# EAGLE design satshakit-grbl (EAGLE 8.4.3)

## Sheet 1 of 2
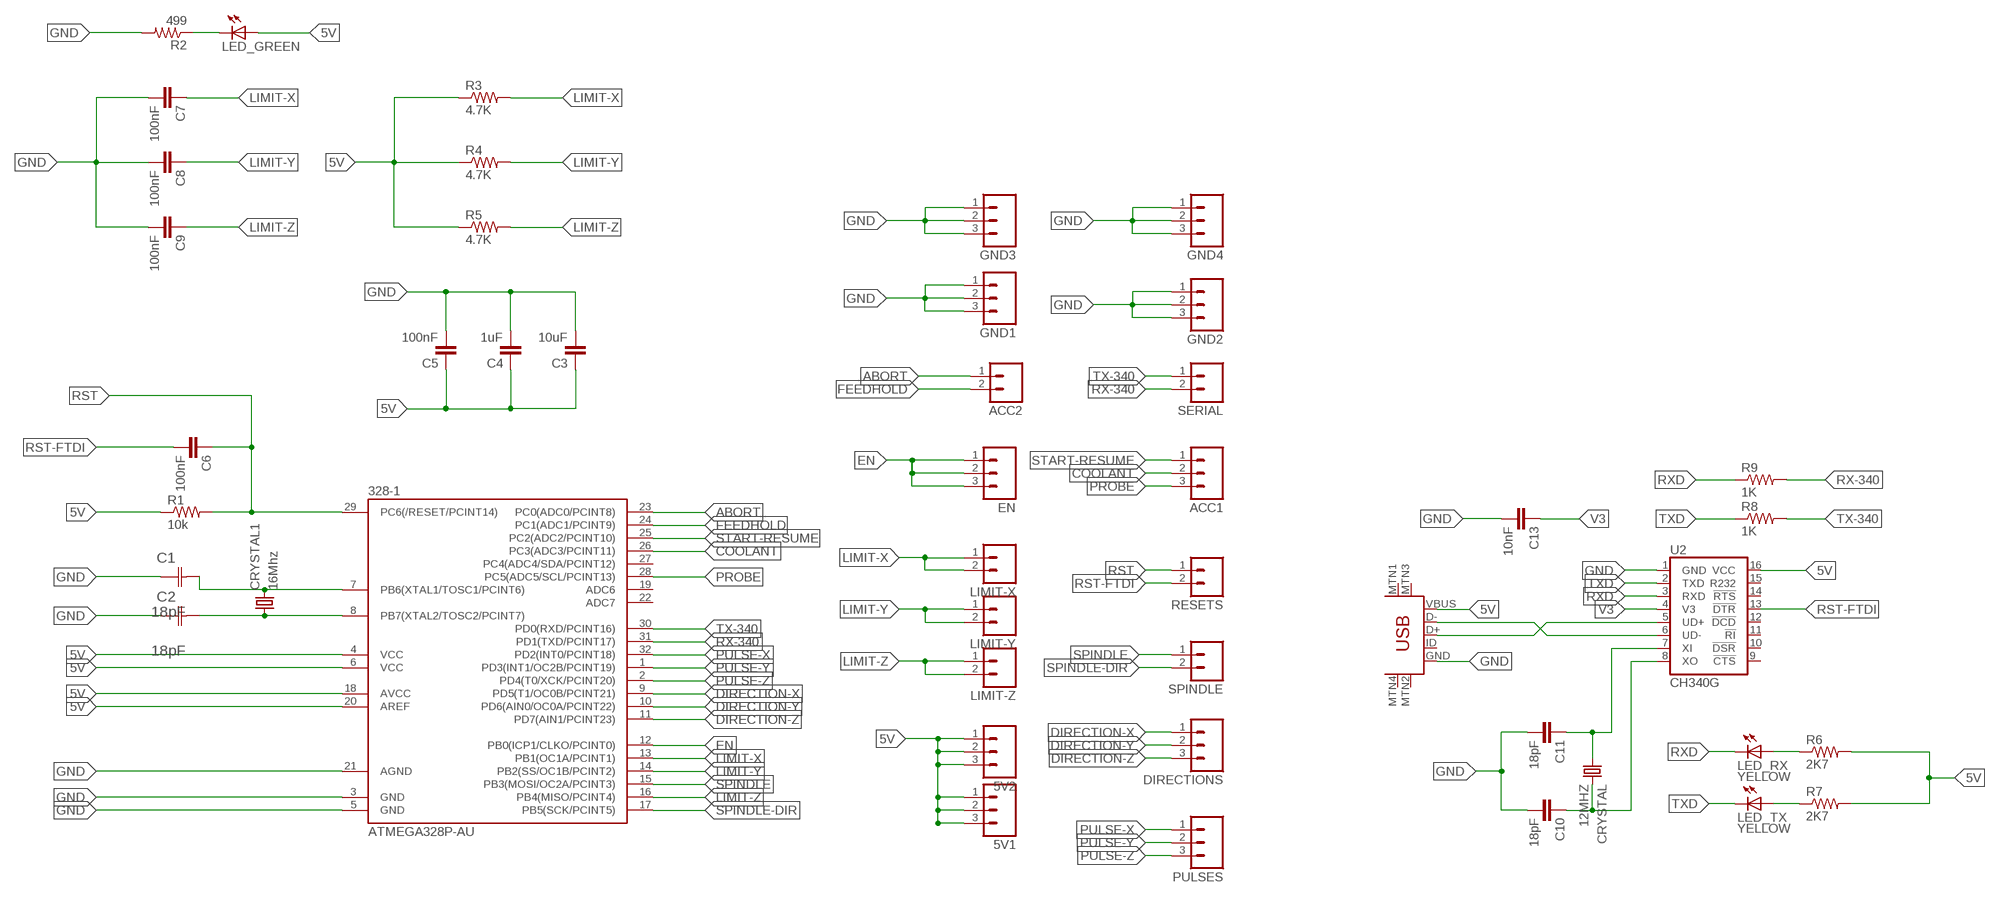
[diagram p0: schematic, sheet 1]

### Parts
5V1  M03  [03P]
5V2  M03  [03P]
328-1  ATMEGA328P-AU  ATMEGA48/88/168-AU  [TQFP32-08]
ACC1  M03  [03P]
ACC2  M02  [02P]
C1  18pF  0612ZC225MAT2A  [CAPC3216X178N]
C2  18pF  0612ZC225MAT2A  [CAPC3216X178N]
C3  10uF  CAP1206  [1206]
C4  1uF  CAP1206  [1206]
C5  100nF  CAP1206  [1206]
C6  100nF  CAP1206  [1206]
C7  100nF  CAP1206  [1206]
C8  100nF  CAP1206  [1206]
C9  100nF  CAP1206  [1206]
C10  18pF  CAP1206  [1206]
C11  18pF  CAP1206  [1206]
C13  10nF  CAP1206  [1206]
CRYSTAL  12MHZ  CSM-7X-DU  [CSM-7X-DU]
CRYSTAL1  16Mhz  CSM-7X-DU  [CSM-7X-DU]
DIRECTIONS  M03  [03P]
EN  M03  [03P]
GND1  M03  [03P]
GND2  M03  [03P]
GND3  M03  [03P]
GND4  M03  [03P]
LED_GREEN  LED1206  [1206]
LED_RX  YELLOW  LED  [LED1206]
LED_TX  YELLOW  LED  [LED1206]
LIMIT-X  M02  [02P]
LIMIT-Y  M02  [02P]
LIMIT-Z  M02  [02P]
PULSES  M03  [03P]
R1  10k  RESISTOR1206  [1206]
R2  499  RESISTOR1206  [1206]
R3  4.7K  RESISTOR1206  [1206]
R4  4.7K  RESISTOR1206  [1206]
R5  4.7K  RESISTOR1206  [1206]
R6  2K7  RES-US1206  [R1206]
R7  2K7  RES-US1206  [R1206]
R8  1K  RES-US1206  [R1206]
R9  1K  RES-US1206  [R1206]
RESETS  M02  [02P]
SERIAL  M02  [02P]
SPINDLE  M02  [02P]
U2  CH340G  CH340GSMD  [SO016]
U$7  USB-MINIB-5PIN  [USB-MINIB]

### Nets
5V: 5V1.1 5V1.2 5V1.3 5V2.1 5V2.2 5V2.3 328-1.4(VCC) 328-1.6(VCC) 328-1.18(AVCC) 328-1.20(AREF) C3.1 C4.1 C5.1 LED_GREEN.1(A) R1.1 R3.1 R4.1 R5.1 R6.2 R7.2 U2.16(VCC) U$7.VBUS
ABORT: 328-1.23(PC0(ADC0/PCINT8)) ACC2.1
COOLANT: 328-1.26(PC3(ADC3/PCINT11)) ACC1.2
DIRECTION-X: 328-1.9(PD5(T1/OC0B/PCINT21)) DIRECTIONS.1
DIRECTION-Y: 328-1.10(PD6(AIN0/OC0A/PCINT22)) DIRECTIONS.2
DIRECTION-Z: 328-1.11(PD7(AIN1/PCINT23)) DIRECTIONS.3
EN: 328-1.12(PB0(ICP1/CLKO/PCINT0)) EN.1 EN.2 EN.3
FEEDHOLD: 328-1.24(PC1(ADC1/PCINT9)) ACC2.2
GND: 328-1.3(GND) 328-1.5(GND) 328-1.21(AGND) C1.1(C1) C2.1(C1) C3.2 C4.2 C5.2 C7.2 C8.2 C9.2 C10.2 C11.2 C13.2 GND1.1 GND1.2 GND1.3 GND2.1 GND2.2 GND2.3 GND3.1 GND3.2 GND3.3 GND4.1 GND4.2 GND4.3 R2.2 U2.1(GND) U$7.GND
LIMIT-X: 328-1.13(PB1(OC1A/PCINT1)) C7.1 LIMIT-X.1 LIMIT-X.2 R3.2
LIMIT-Y: 328-1.14(PB2(SS/OC1B/PCINT2)) C8.1 LIMIT-Y.1 LIMIT-Y.2 R4.2
LIMIT-Z: 328-1.16(PB4(MISO/PCINT4)) C9.1 LIMIT-Z.1 LIMIT-Z.2 R5.2
N$1: U2.5(UD+) U$7.D+
N$2: 328-1.7(PB6(XTAL1/TOSC1/PCINT6)) C1.2(C2) CRYSTAL1.2
N$3: U2.6(UD-) U$7.D-
N$7: LED_RX.1(A) R6.1
N$8: LED_TX.1(A) R7.1
N$9: 328-1.8(PB7(XTAL2/TOSC2/PCINT7)) C2.2(C2) CRYSTAL1.1
N$26: LED_GREEN.2(C) R2.1
OSC_IN: C10.1 CRYSTAL.2 U2.8(XO)
OSC_OUT: C11.1 CRYSTAL.1 U2.7(XI)
PROBE: 328-1.28(PC5(ADC5/SCL/PCINT13)) ACC1.3
PULSE-X: 328-1.32(PD2(INT0/PCINT18)) PULSES.1
PULSE-Y: 328-1.1(PD3(INT1/OC2B/PCINT19)) PULSES.2
PULSE-Z: 328-1.2(PD4(T0/XCK/PCINT20)) PULSES.3
RST: 328-1.29(PC6(/RESET/PCINT14)) C6.1 R1.2 RESETS.1
RST-FTDI: C6.2 RESETS.2 U2.13(!DTR)
RX-340: 328-1.31(PD1(TXD/PCINT17)) R9.2 SERIAL.2
RXD: LED_RX.2(C) R9.1 U2.3(RXD)
SPINDLE: 328-1.15(PB3(MOSI/OC2A/PCINT3)) SPINDLE.1
SPINDLE-DIR: 328-1.17(PB5(SCK/PCINT5)) SPINDLE.2
START-RESUME: 328-1.25(PC2(ADC2/PCINT10)) ACC1.1
TX-340: 328-1.30(PD0(RXD/PCINT16)) R8.2 SERIAL.1
TXD: LED_TX.2(C) R8.1 U2.2(TXD)
V3: C13.1 U2.4(V3)
Unconnected: 328-1.19(ADC6) 328-1.22(ADC7) 328-1.27(PC4(ADC4/SDA/PCINT12)) U2.9(!CTS) U2.10(!DSR) U2.11(!RI) U2.12(!DCD) U2.14(!RTS) U2.15(R232) U$7.ID U$7.MTN1(MTN2) U$7.MTN2(MTN3) U$7.MTN3(MTN1) U$7.MTN4

## Sheet 2 of 2

## Library data of the parts
5V1 5V2 ACC1 DIRECTIONS EN GND1-GND4 PULSES = con-amp-quick:M03: AMP QUICK CONNECTOR; OC_FARNELL: unknown; OC_NEWARK: unknown
328-1 = atmega8:ATMEGA48/88/168
ACC2 LIMIT-X LIMIT-Y LIMIT-Z RESETS SERIAL SPINDLE = con-amp-quick:M02: AMP QUICK CONNECTOR; OC_FARNELL: unknown; OC_NEWARK: unknown
C1 C2 = AVX_By_element14_Batch_1:0612ZC225MAT2A: Capacitor 1206; MPN: 0612ZC225MAT2A; OC_FARNELL: -; OC_NEWARK: 12N3209; SUPPLIER: AVX; TOLERANCE: ±20%; VALUE: 2.2µF; VOLTAGERATING: 10V
C3-C11 C13 = 01_SparkFun:CAP: Capacitor Standard 0603 ceramic capacitor, and 0.1" leaded capacitor.
CRYSTAL = flight_controller.lbr01_FAB_Hello:CSM-7X-DU: SMD CRYSTAL Source: www.ecsxtal.com .. Crystal 3.6864MHz CSM_7X_DU.PDF; OC_FARNELL: unknown; OC_NEWARK: unknown
CRYSTAL1 = 01_FAB_Hello:CSM-7X-DU: SMD CRYSTAL Source: www.ecsxtal.com .. Crystal 3.6864MHz CSM_7X_DU.PDF; OC_FARNELL: unknown; OC_NEWARK: unknown
LED_GREEN = 01_FAB_Hello:LED
LED_RX LED_TX = fab:LED: LED
R1-R5 = 01_SparkFun:RESISTOR: Resistor Basic schematic elements and footprints for 0603, 1206, and PTH 1/10th watt (small) resistors.
R6-R9 = fab:RES-US: Resistor (US Symbol) Variants with postfix FAB are widened to allow the routing of internal traces
U2 = SparkFun-DigitalIC:CH340G: A simple USB 2.0 to Serial IC.; PROD_ID: IC-13498
U$7 = SparkFun:USB-MINIB

## Board
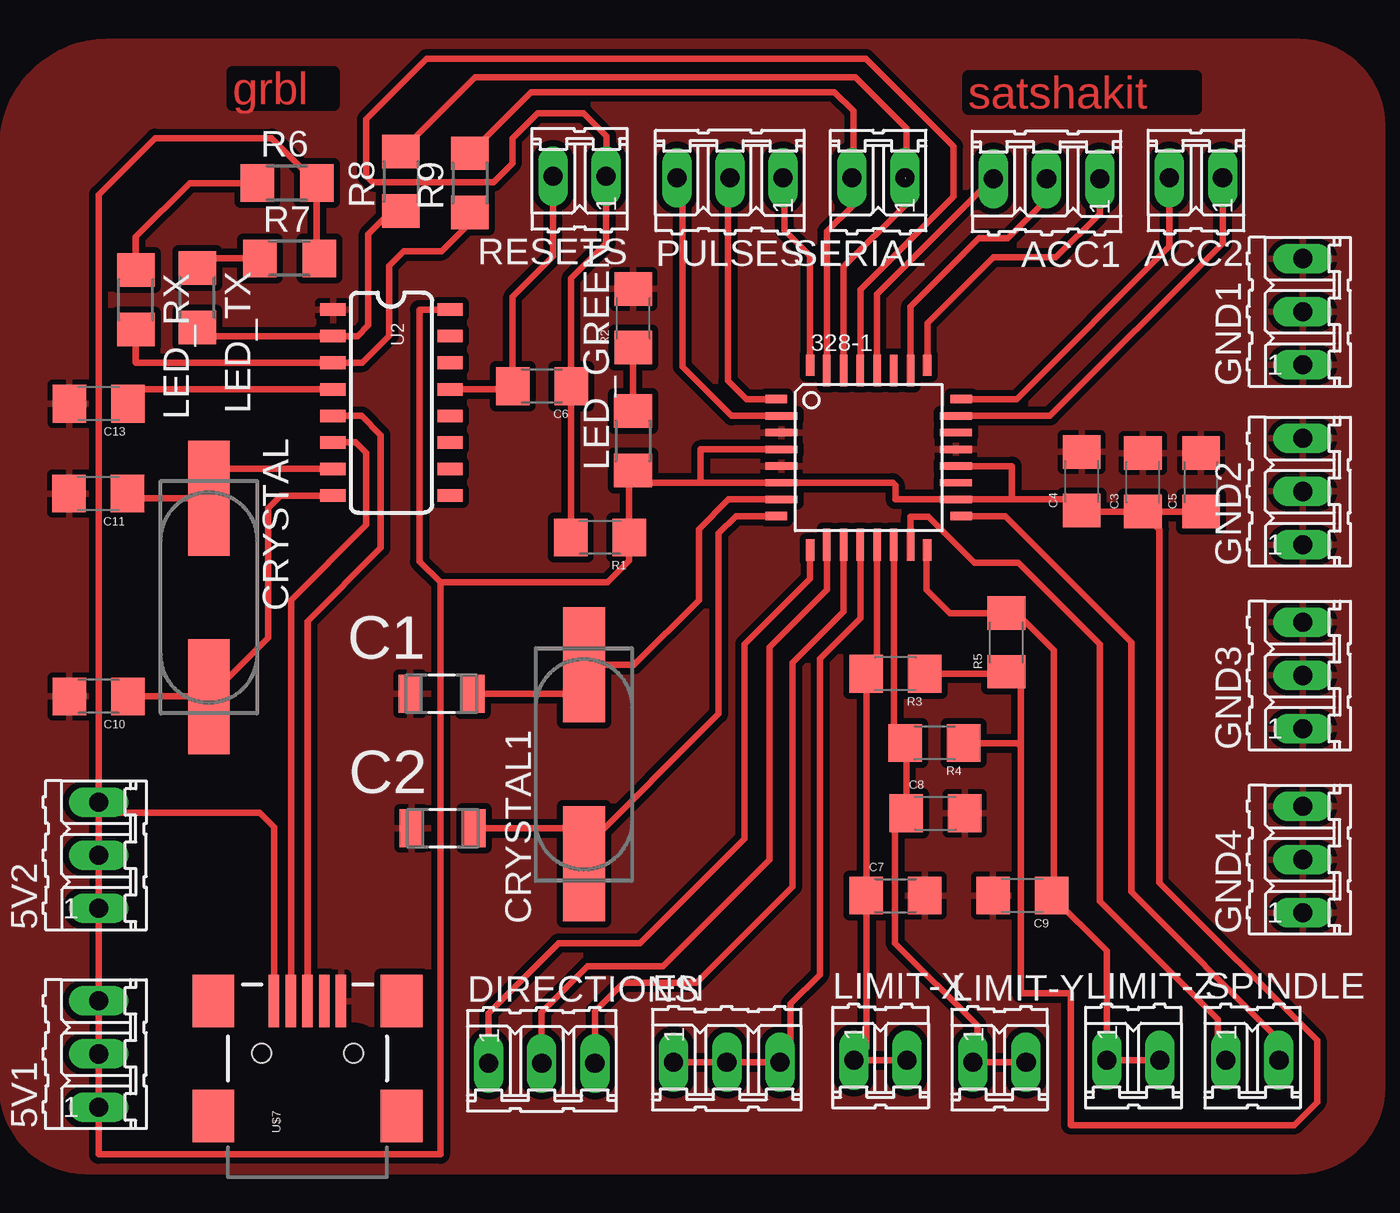
[diagram p1: board, top side]

No outline drawn. Coordinates in mm, seen from the top.
Copper layers (1*16): Top 0.035mm / dielectric 1.5mm / Bottom 0.035mm
Design rules "default": minimum track width 10mil, minimum drill 24mil, track to track 8mil, track to pad 8mil, pad to pad 8mil, via to via 8mil, smd to smd 8mil, copper to edge 40mil, drill to drill 8mil, minimum pad ring 10mil, minimum via ring 8mil, stop-mask expansion 4mil, vias tented up to drill 0mil, thermal gap 10mil

### Footprints (pad centres in the part's own frame; a part is rotated, then mirrored left to right if it is on the bottom)
03P = drill 0.914 long: 1 -2.54,0; 2 0,0; 3 2.54,0
TQFP32-08 = smd 1.016 x 0.406: 1 -4.42,2.8; 8 -4.42,-2.8; 17 4.42,-2.8; 24 4.42,2.8 | smd 1.524 x 0.356: 2 -4.166,2; 3 -4.166,1.2; 4 -4.166,0.4; 5 -4.166,-0.4; 6 -4.166,-1.2; 7 -4.166,-2; 18 4.166,-2; 19 4.166,-1.2; 20 4.166,-0.4; 21 4.166,0.4; 22 4.166,1.2; 23 4.166,2 | smd 0.406 x 1.016: 9 -2.8,-4.42; 16 2.8,-4.42; 25 2.8,4.42; 32 -2.8,4.42 | smd 0.356 x 1.524: 10 -2,-4.166; 11 -1.2,-4.166; 12 -0.4,-4.166; 13 0.4,-4.166; 14 1.2,-4.166; 15 2,-4.166; 26 2,4.166; 27 1.2,4.166; 28 0.4,4.166; 29 -0.4,4.166; 30 -1.2,4.166; 31 -2,4.166
02P = drill 0.914 long: 1 -1.27,0; 2 1.27,0
CAPC3216X178N = smd 1.118 x 1.803: 1 -1.499,0; 2 1.499,0
1206 = smd 1.6 x 1.8: 1 -1.4,0; 2 1.4,0
CSM-7X-DU = smd 5.5 x 2: 1 -4.75,0; 2 4.75,0
1206' = smd 1.6 x 1.803: 1 -1.422,0; 2 1.422,0
LED1206 = smd 1.6 x 1.803: 1 -1.422,0; 2 1.422,0
R1206 = smd 1.6 x 1.803: 1 -1.422,0; 2 1.422,0
SO016 = smd 0.6 x 1.2: 1 -4.445,-2.8; 2 -3.175,-2.8; 3 -1.905,-2.8; 4 -0.635,-2.8; 5 0.635,-2.8; 6 1.905,-2.8; 7 3.175,-2.8; 8 4.445,-2.8; 9 4.445,2.8; 10 3.175,2.8; 11 1.905,2.8; 12 0.635,2.8; 13 -0.635,2.8; 14 -1.905,2.8; 15 -3.175,2.8; 16 -4.445,2.8
USB-MINIB = smd 2.5 x 0.5: D+ 2.5,0; D- 2.5,0.8; GND 2.5,-1.6; ID 2.5,-0.8; VBUS 2.5,1.6 | smd 2.5 x 2: MTN1 -3,4.5; MTN2 2.5,4.5; MTN3 -3,-4.5; MTN4 2.5,-4.5 | hole 0.9: 0,2.2; 0,-2.2

### Placement (x,y rotation side)
5V1  38.6,26.6 90 top
5V2  38.6,36.1 90 top
328-1  75.44,55.12 0 top
ACC1  83.95,68.45 180 top
ACC2  91.1,68.5 180 top
C1  55,43.82 0 top
C2  55.06,37.4 0 top
C3  88.56,53.94 90 top
C4  85.63,53.99 90 top
C5  91.34,53.94 90 top
C6  59.8,58.54 180 top
C7  76.72,34.17 0 top
C8  78.63,38.11 0 top
C9  82.79,34.18 180 top
C10  38.6,43.7 180 top
C11  38.58,53.4 180 top
C13  38.6,57.7 180 top
CRYSTAL  43.88,48.43 270 top
CRYSTAL1  61.82,40.45 90 top
DIRECTIONS  59.8,26.15 0 top
EN  68.65,26.2 0 top
GND1  96.2,62.1 90 top
GND2  96.2,53.5 90 top
GND3  96.2,44.7 90 top
GND4  96.2,35.9 90 top
LED_GREEN  [1206']  64.16,55.92 90 top
LED_RX  40.38,62.66 270 top
LED_TX  43.32,62.76 270 top
LIMIT-X  76,26.3 0 top
LIMIT-Y  81.7,26.2 0 top
LIMIT-Z  88.1,26.3 0 top
PULSES  68.8,68.5 180 top
R1  62.58,51.3 180 top
R2  64.18,61.79 90 top
R3  76.71,44.78 180 top
R4  78.59,41.47 180 top
R5  82.03,46.28 90 top
R6  47.61,68.25 0 top
R7  47.73,64.65 0 top
R8  53.06,68.34 90 top
R9  56.36,68.25 90 top
RESETS  61.61,68.58 180 top
SERIAL  75.9,68.5 180 top
SPINDLE  93.8,26.3 0 top
U2  52.61,57.75 270 top
U$7  48.59,26.63 90 top

### Tracks (layer width: path | path; a pad name or v marks a point on that pad's centre or on a via)
5V
  Top 0.254: 328-1.20 78.99,54.72 78.99,54.74
  Top 0.305: 328-1.18 | 328-1.20 | 79.6,53.09 328-1.18 | 328-1.20 78.99,54.74 | 71.96,53.92 328-1.6 | 328-1.18 76.71,53.12 76.71,53.8 76.59,53.92 328-1.6 | R3.1 81.83,44.78 R5.1 82.73,44.18 82.73,41.3 | R4.1 82.56,41.47 82.73,41.3 | 82.73,41.3 82.73,29.5 85.1,29.5 85.1,23.2 95.8,23.2 96.9,24.3 96.9,27.25 89.35,34.8 89.35,51.68 88.47,52.56 | 67.4,53.92 328-1.6 | 67.4,53.92 64.16,53.92 LED_GREEN.1 63.98,54.5 R1.1 63.98,50.18 62.95,49.15 54.95,49.15 | R6.2 49.08,68.2 | R6.2 49.04,64.76 R7.2 | R6.2 46.88,70.4 41.3,70.4 38.6,67.7 5V2.3 | U2.16 53.95,62.2 53.95,50.15 54.95,49.15 | 87.81,52.59 C3.1 | 88.21,52.19 C3.1 | 54.95,49.15 54.95,21.8 38.6,21.8 5V1.1 5V1.2 5V1.3 5V2.1 5V2.2 5V2.3 | U$7.VBUS 47,28.93 47,37.45 46.31,38.14 39.1,38.14 5V2.3 | 328-1.4 67.4,55.52 67.4,53.92 | 88.47,52.56 88.31,52.59 | 88.47,52.56 C3.1 | C3.1 C5.1 | C3.1 85.68,52.54 C4.1 85.1,53.12 82.3,53.12 | 82.3,53.12 328-1.18 | 328-1.20 82.3,54.72 82.3,53.12
ABORT
  Top 0.305: 328-1.23 84.12,57.12 92.37,65.37 ACC2.1
COOLANT
  Top 0.305: 328-1.26 77.44,62.34 80.7,65.6 82.1,65.6 83.95,67.45 ACC1.2
DIRECTION-X
  Top 0.305: 328-1.9 72.64,49.34 69.5,46.2 69.5,36.9 64.5,31.9 60.6,31.9 57.26,28.56 DIRECTIONS.1
DIRECTION-Y
  Top 0.305: 328-1.10 73.44,48.8 70.7,46.06 70.7,35.9 65.6,30.8 62,30.8 59.8,28.6 DIRECTIONS.2
DIRECTION-Z
  Top 0.305: 328-1.11 74.24,47.74 71.8,45.3 71.8,34.6 67.2,30 63.7,30 62.34,28.64 DIRECTIONS.3
EN
  Top 0.305: 75.06,50.95 328-1.12 75.04,47.44 73.1,45.5 73.1,30.4 71.69,28.99 71.69,26.7 EN.3 EN.2 EN.1
FEEDHOLD
  Top 0.305: 328-1.24 82.52,57.92 89.83,65.23 ACC2.2
GND
  Top 0.305: 328-1.5 | 328-1.21
  pour Top (isolate 0.305): 34,43 34,70 arc-90 39,75 96,75 arc-90 100,71 100,25 arc-90 96,21 38,21 arc-90 34,25
LIMIT-X
  Top 0.305: 328-1.13 75.84,44.78 R3.2 75.32,44.77 75.32,34.3 | 75.32,34.2 75.32,34.3 | 75.32,34.2 C7.1 75.32,26.89 LIMIT-X.1 LIMIT-X.2 | 75.93,33.69 75.32,34.3 | 75.53,33.99 75.32,34.2 | 75.23,34.11 75.32,34.2
LIMIT-Y
  Top 0.305: C8.1 77.23,41.43 R4.2 76.64,42.02 328-1.14 | 76.9,37.78 C8.1 | C8.1 76.7,37.58 76.7,31.9 80.63,27.97 80.63,26.4 LIMIT-Y.1 LIMIT-Y.2
LIMIT-Z
  Top 0.305: 328-1.16 78.2,50.66 78.2,48.8 79.32,47.68 R5.2 82.52,47.68 84.3,45.9 84.3,34.29 C9.1 86.83,31.53 LIMIT-Z.1 LIMIT-Z.2
N$1
  Top 0.305: U2.5 51.18,57.12 52.1,56.2 52.1,50.8 48.6,47.3 48.6,28.93 U$7.D+
N$2
  Top 0.305: 71.27,53.09 328-1.7 68.74,53.12 67.31,51.69 67.31,48.31 64.2,45.2 CRYSTAL1.2 61.82,43.82 C1.2
N$3
  Top 0.305: U2.6 50.9,55.85 51.4,55.35 51.4,51.9 47.8,48.3 47.8,28.93 U$7.D-
N$7
  Top 0.305: LED_RX.1 40.38,65.68 42.95,68.25 R6.1
N$8
  Top 0.305: R7.1 43.78,64.65 LED_TX.1
N$9
  Top 0.305: 328-1.8 69.08,52.32 68.26,51.5 68.26,42.86 61.82,36.42 | 61,34.39 61,35.6 61.55,36.15 61.82,35.88 CRYSTAL1.1 61.82,36.42 | C2.2 61.82,37.4 61.82,36.42
N$26
  Top 0.305: LED_GREEN.2 64.16,60.39 R2.1
OSC_IN
  Top 0.305: CRYSTAL.2 43.86,43.7 | U2.8 47.31,53.31 46.7,52.7 46.7,46.51 CRYSTAL.2 | C10.1 43.86,43.7 | 43.86,43.7 CRYSTAL.2
OSC_OUT
  Top 0.305: U2.7 44.18,54.58 44,54.4 44,53.31 CRYSTAL.1 | 43.66,53.4 CRYSTAL.1 | CRYSTAL.1 39.98,53.18 C11.1
PROBE
  Top 0.305: 328-1.28 75.84,62.94 81.35,68.45 ACC1.3
PULSE-X
  Top 0.305: 328-1.32 72.64,64.76 71.4,66 71.4,68.44 PULSES.1
PULSE-Y
  Top 0.305: 328-1.1 69.58,57.92 68.7,58.8 68.7,68.13 68.8,68.23 PULSES.2
PULSE-Z
  Top 0.305: 328-1.2 68.88,57.12 66.53,59.47 66.53,68.23 PULSES.3
RST
  Top 0.305: R1.2 61.2,51.32 C6.1 61.2,63.7 62.88,65.38 RESETS.1 62.9,68.6 62.9,70.5 61.8,71.6 59.6,71.6 58.4,70.4 58.4,69.2 57.5,68.3 51.7,68.3 51.4,68.6 51.4,71.3 54.3,74.2 75.3,74.2 79.5,70 79.5,67.6 75.04,63.14 328-1.29
RST-FTDI
  Top 0.305: U2.13 58.4,58.39 C6.2 58.4,62.8 60.34,64.74 RESETS.2
RX-340
  Top 0.305: R9.2 59.28,72.6 73.8,72.6 74.7,71.7 74.7,68.57 SERIAL.2 74.63,67.17 74.65,67.15 | 74.65,67.15 74.7,67.2 | 74.65,67.15 73.44,65.94 328-1.31
RXD
  Top 0.305: LED_RX.2 40.38,59.66 U2.3 51.21,59.66 52.5,60.95 52.5,64.3 53.2,65 55,65 56.36,66.36 R9.1 56.36,66.26
SPINDLE
  Top 0.305: 328-1.15 77.44,52.3 78.3,52.3 80.5,50.1 82.6,50.1 86.5,46.2 86.5,33.9 92.13,28.27 92.13,26.7 SPINDLE.1
SPINDLE-DIR
  Top 0.305: 328-1.17 81.98,52.32 88,46.3 88,34.35 95.07,27.28 SPINDLE.2
START-RESUME
  Top 0.305: 328-1.25 78.24,61.54 81.4,64.7 84.4,64.7 86.49,66.79 ACC1.1
TX-340  (1 unrouted)
  Top 0.305: R8.2 56.6,73.3 74.8,73.3 77.24,70.86 77.24,68.57 SERIAL.1 | 77.2,68.46 77.2,67.2 74.24,64.24 328-1.30
TXD
  Top 0.305: R8.1 53.06,66.8 52.5,66.8 51.5,65.8 51.5,61.45 50.98,60.93 U2.2 43.32,60.93 LED_TX.2
V3
  Top 0.305: U2.4 40,58.39 C13.1

### Text on the board
Top: grbl | satshakit